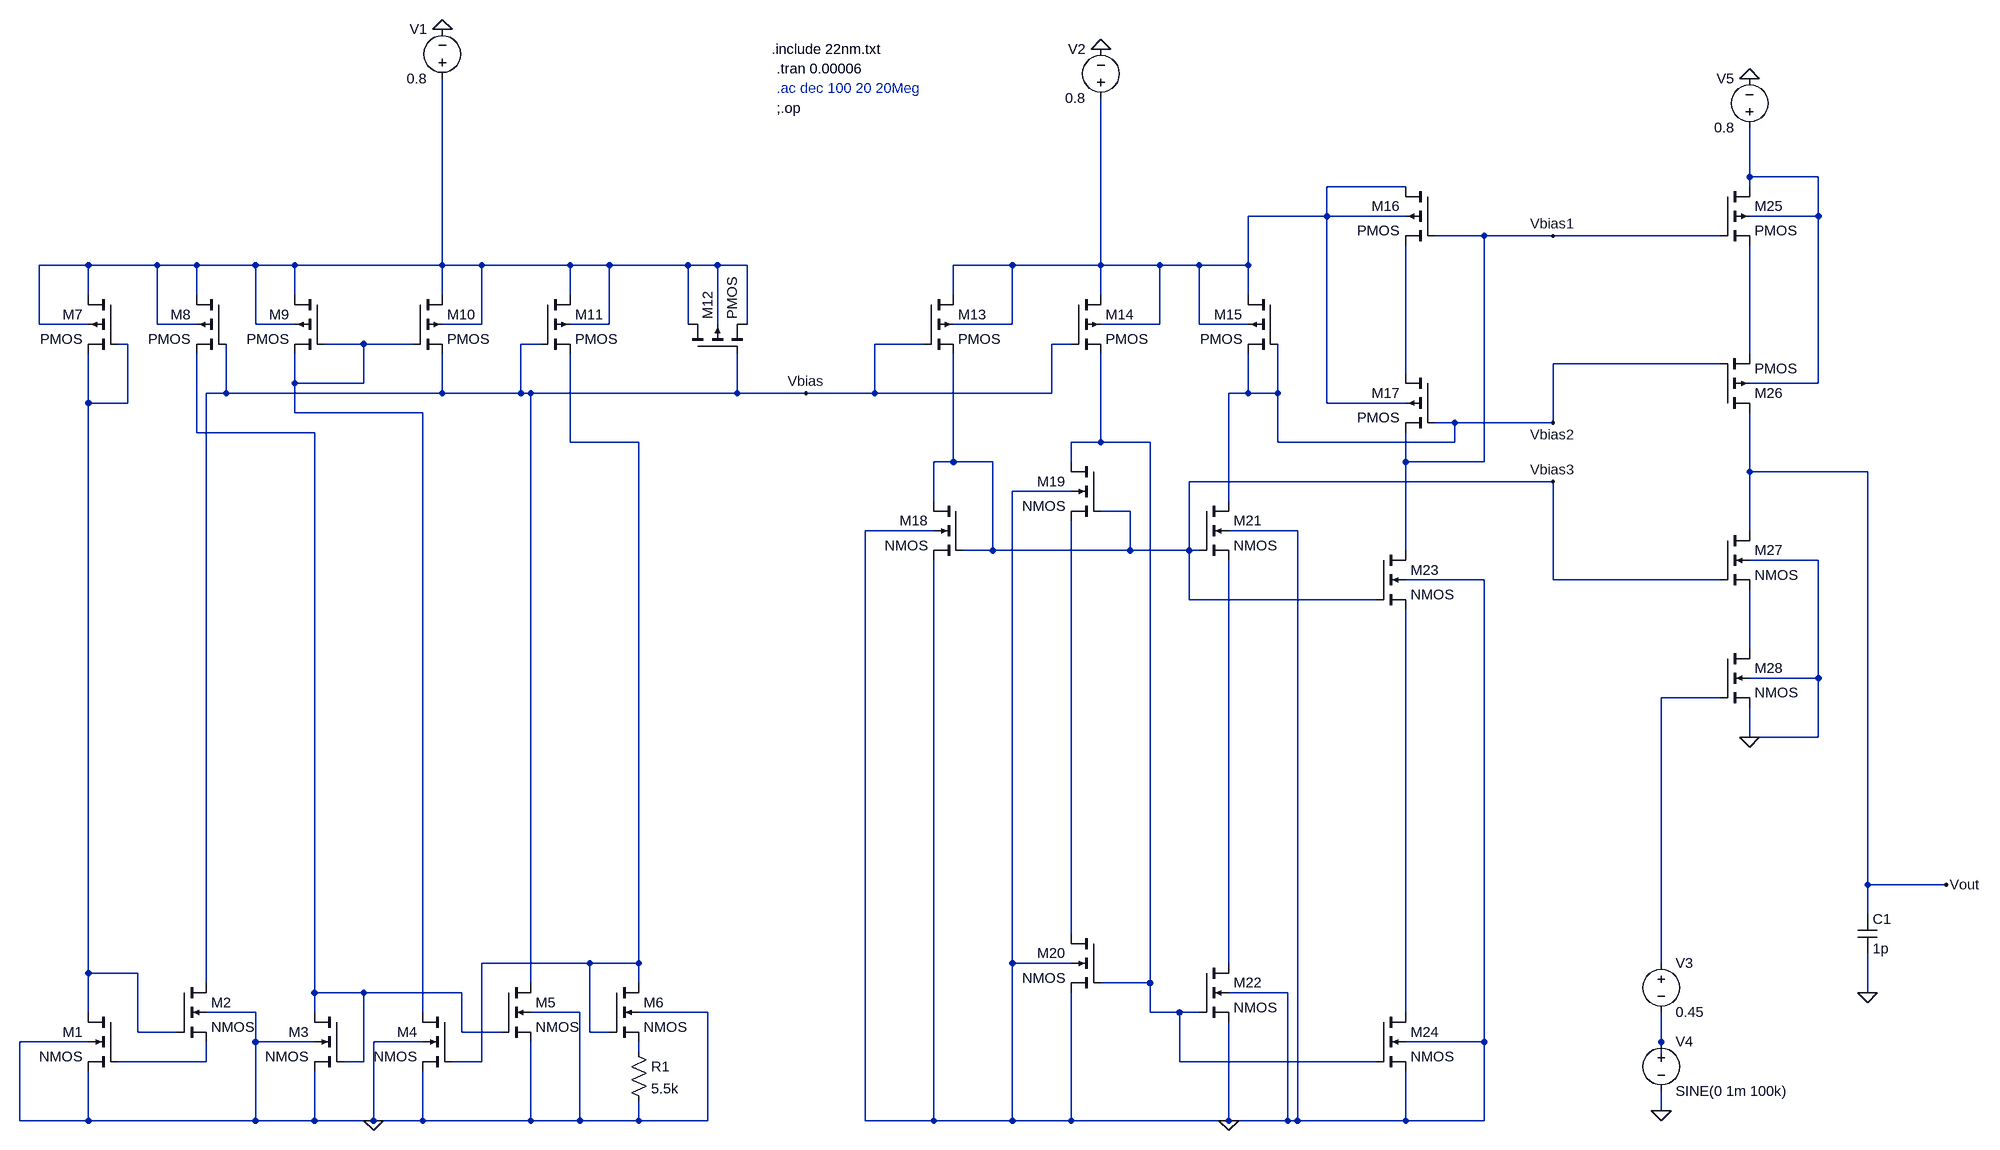
[diagram p0: schematic 22nm_aman3.asc]
22nm_aman3.asc, the LTspice schematic file:
Version 4
SHEET 1 1816 1108
WIRE 1232 -448 1232 -528
WIRE 1344 -448 1232 -448
WIRE 672 -432 544 -432
WIRE 1232 -432 1232 -448
WIRE 544 -384 544 -432
WIRE 544 -384 416 -384
WIRE 672 -384 544 -384
WIRE 1344 -384 1344 -448
WIRE 1344 -384 1232 -384
WIRE 800 -352 720 -352
WIRE 912 -352 800 -352
WIRE 1184 -352 912 -352
WIRE -1472 -304 -1552 -304
WIRE -1360 -304 -1472 -304
WIRE -1296 -304 -1360 -304
WIRE -1200 -304 -1296 -304
WIRE -1136 -304 -1200 -304
WIRE -896 -304 -896 -608
WIRE -896 -304 -1136 -304
WIRE -832 -304 -896 -304
WIRE -688 -304 -832 -304
WIRE -624 -304 -688 -304
WIRE -496 -304 -624 -304
WIRE -448 -304 -496 -304
WIRE -400 -304 -448 -304
WIRE 32 -304 -64 -304
WIRE 176 -304 176 -576
WIRE 176 -304 32 -304
WIRE 272 -304 176 -304
WIRE 336 -304 272 -304
WIRE 416 -304 416 -384
WIRE 416 -304 336 -304
WIRE -1472 -256 -1472 -304
WIRE -1296 -256 -1296 -304
WIRE -1136 -256 -1136 -304
WIRE -896 -256 -896 -304
WIRE -688 -256 -688 -304
WIRE -64 -256 -64 -304
WIRE 176 -256 176 -304
WIRE 416 -256 416 -304
WIRE -1552 -208 -1552 -304
WIRE -1472 -208 -1552 -208
WIRE -1360 -208 -1360 -304
WIRE -1296 -208 -1360 -208
WIRE -1200 -208 -1200 -304
WIRE -1136 -208 -1200 -208
WIRE -832 -208 -832 -304
WIRE -832 -208 -896 -208
WIRE -624 -208 -624 -304
WIRE -624 -208 -688 -208
WIRE -496 -208 -496 -304
WIRE -448 -208 -448 -304
WIRE -400 -208 -400 -304
WIRE 32 -208 32 -304
WIRE 32 -208 -64 -208
WIRE 272 -208 272 -304
WIRE 272 -208 176 -208
WIRE 336 -208 336 -304
WIRE 416 -208 336 -208
WIRE -1408 -176 -1424 -176
WIRE -1024 -176 -1088 -176
WIRE -944 -176 -1024 -176
WIRE -736 -176 -768 -176
WIRE -112 -176 -192 -176
WIRE 128 -176 96 -176
WIRE 1232 -160 1232 -336
WIRE 1184 -144 912 -144
WIRE 672 -128 672 -336
WIRE -1136 -112 -1136 -160
WIRE -1024 -112 -1024 -176
WIRE -1024 -112 -1136 -112
WIRE 1344 -112 1344 -384
WIRE 1344 -112 1232 -112
WIRE -1248 -96 -1248 -176
WIRE -1248 -96 -1280 -96
WIRE -896 -96 -896 -160
WIRE -896 -96 -1248 -96
WIRE -768 -96 -768 -176
WIRE -768 -96 -896 -96
WIRE -752 -96 -768 -96
WIRE -416 -96 -416 -160
WIRE -416 -96 -752 -96
WIRE -304 -96 -416 -96
WIRE -192 -96 -192 -176
WIRE -192 -96 -304 -96
WIRE 96 -96 96 -176
WIRE 96 -96 -192 -96
WIRE 416 -96 416 -160
WIRE 416 -96 384 -96
WIRE 464 -96 464 -176
WIRE 464 -96 416 -96
WIRE -1472 -80 -1472 -160
WIRE -1408 -80 -1408 -176
WIRE -1408 -80 -1472 -80
WIRE 544 -80 544 -384
WIRE 672 -80 544 -80
WIRE -1136 -64 -1136 -112
WIRE -928 -64 -1136 -64
WIRE 752 -48 720 -48
WIRE 912 -48 912 -144
WIRE 912 -48 752 -48
WIRE -1296 -32 -1296 -160
WIRE -1104 -32 -1296 -32
WIRE -688 -16 -688 -160
WIRE -576 -16 -688 -16
WIRE 176 -16 176 -160
WIRE 176 -16 128 -16
WIRE 256 -16 176 -16
WIRE 464 -16 464 -96
WIRE 752 -16 752 -48
WIRE 752 -16 464 -16
WIRE -64 16 -64 -160
WIRE -64 16 -96 16
WIRE 0 16 -64 16
WIRE 128 16 128 -16
WIRE 672 16 672 -32
WIRE 800 16 800 -352
WIRE 800 16 672 16
WIRE 1232 32 1232 -64
WIRE 1424 32 1232 32
WIRE 912 48 320 48
WIRE 128 64 32 64
WIRE -96 80 -96 16
WIRE 384 80 384 -96
WIRE 224 96 176 96
WIRE -96 128 -208 128
WIRE 496 128 384 128
WIRE 1232 128 1232 32
WIRE 0 160 0 16
WIRE 0 160 -48 160
WIRE 224 160 224 96
WIRE 224 160 0 160
WIRE 320 160 320 48
WIRE 320 160 224 160
WIRE 336 160 320 160
WIRE 672 160 672 16
WIRE 1344 176 1232 176
WIRE 800 208 672 208
WIRE 912 208 912 48
WIRE 1184 208 912 208
WIRE 320 240 320 160
WIRE 624 240 320 240
WIRE 1232 320 1232 224
WIRE 1344 368 1344 176
WIRE 1344 368 1232 368
WIRE 1184 400 1088 400
WIRE 1232 464 1232 416
WIRE 1344 464 1344 368
WIRE 1344 464 1232 464
WIRE 1424 704 1424 32
WIRE 1552 704 1424 704
WIRE 1424 752 1424 704
WIRE 128 784 128 112
WIRE -656 832 -832 832
WIRE -576 832 -576 -16
WIRE -576 832 -656 832
WIRE 32 832 32 64
WIRE 128 832 32 832
WIRE 384 832 384 176
WIRE 1088 832 1088 400
WIRE -1472 848 -1472 -80
WIRE -1392 848 -1472 848
WIRE -1280 864 -1280 -96
WIRE -752 864 -752 -96
WIRE -576 864 -576 832
WIRE 256 864 256 -16
WIRE 256 864 176 864
WIRE -1104 880 -1104 -32
WIRE -1024 880 -1104 880
WIRE -864 880 -1024 880
WIRE 480 880 384 880
WIRE 1424 880 1424 816
WIRE -1472 912 -1472 848
WIRE -1200 912 -1280 912
WIRE -1104 912 -1104 880
WIRE -928 912 -928 -64
WIRE -672 912 -752 912
WIRE -464 912 -576 912
WIRE 256 912 256 864
WIRE 304 912 256 912
WIRE 336 912 304 912
WIRE 672 912 672 256
WIRE -1392 944 -1392 848
WIRE -1328 944 -1392 944
WIRE -864 944 -864 880
WIRE -800 944 -864 944
WIRE -656 944 -656 832
WIRE -624 944 -656 944
WIRE -1472 960 -1584 960
WIRE -1200 960 -1200 912
WIRE -1104 960 -1200 960
WIRE -928 960 -1008 960
WIRE 800 960 800 208
WIRE 800 960 672 960
WIRE 1088 960 1088 912
WIRE -576 976 -576 960
WIRE -1280 992 -1280 960
WIRE -1280 992 -1424 992
WIRE -1024 992 -1024 880
WIRE -1024 992 -1056 992
WIRE -832 992 -832 832
WIRE -832 992 -880 992
WIRE 304 992 304 912
WIRE 624 992 304 992
WIRE 1088 992 1088 960
WIRE 1088 1072 1088 1040
WIRE -1584 1088 -1584 960
WIRE -1472 1088 -1472 1008
WIRE -1472 1088 -1584 1088
WIRE -1200 1088 -1200 960
WIRE -1200 1088 -1472 1088
WIRE -1104 1088 -1104 1008
WIRE -1104 1088 -1200 1088
WIRE -1008 1088 -1008 960
WIRE -1008 1088 -1104 1088
WIRE -928 1088 -928 1008
WIRE -928 1088 -1008 1088
WIRE -752 1088 -752 960
WIRE -752 1088 -928 1088
WIRE -672 1088 -672 912
WIRE -672 1088 -752 1088
WIRE -576 1088 -576 1056
WIRE -576 1088 -672 1088
WIRE -464 1088 -464 912
WIRE -464 1088 -576 1088
WIRE -208 1088 -208 128
WIRE -96 1088 -96 176
WIRE -96 1088 -208 1088
WIRE 32 1088 32 832
WIRE 32 1088 -96 1088
WIRE 128 1088 128 880
WIRE 128 1088 32 1088
WIRE 384 1088 384 928
WIRE 384 1088 128 1088
WIRE 480 1088 480 880
WIRE 480 1088 384 1088
WIRE 496 1088 496 128
WIRE 496 1088 480 1088
WIRE 672 1088 672 1008
WIRE 672 1088 496 1088
WIRE 800 1088 800 960
WIRE 800 1088 672 1088
FLAG -1008 1088 0
FLAG -896 -688 0
FLAG -304 -96 Vbias
FLAG 384 1088 0
FLAG 176 -656 0
FLAG 912 -352 Vbias1
FLAG 912 -48 Vbias2
FLAG 912 48 Vbias3
FLAG 1088 1072 0
FLAG 1232 464 0
FLAG 1232 -608 0
FLAG 1424 880 0
FLAG 1552 704 Vout
SYMBOL nmos4 -1424 912 M0
SYMATTR InstName M1
SYMATTR Value2 l=0.044u w=0.22u
SYMBOL nmos4 -1328 864 R0
SYMATTR InstName M2
SYMATTR Value2 l=0.044u w=0.088u
SYMBOL nmos4 -1056 912 M0
SYMATTR InstName M3
SYMATTR Value2 l=0.044u w=0.22u
SYMBOL nmos4 -880 912 M0
SYMATTR InstName M4
SYMATTR Value2 l=0.044u w=0.22u
SYMBOL nmos4 -800 864 R0
SYMATTR InstName M5
SYMATTR Value2 l=0.044u w=0.22u
SYMBOL nmos4 -624 864 R0
SYMATTR InstName M6
SYMATTR Value2 l=0.044u w=0.66u
SYMBOL pmos4 -1424 -256 M0
SYMATTR InstName M7
SYMATTR Value2 l=0.44u w=0.22u
SYMBOL pmos4 -1248 -256 M0
SYMATTR InstName M8
SYMATTR Value2 l=0.044u w=0.528u
SYMBOL pmos4 -1088 -256 M0
SYMATTR InstName M9
SYMATTR Value2 l=0.044u w=0.528u
SYMBOL pmos4 -944 -256 R0
SYMATTR InstName M10
SYMATTR Value2 l=0.044u w=0.528u
SYMBOL pmos4 -736 -256 R0
SYMATTR InstName M11
SYMATTR Value2 l=0.044u w=0.528u
SYMBOL pmos4 -496 -160 R270
SYMATTR InstName M12
SYMATTR Value2 l=1.1u w=1.1u
SYMBOL res -592 960 R0
SYMATTR InstName R1
SYMATTR Value 5.5k
SYMBOL voltage -896 -592 R180
WINDOW 0 24 96 Left 2
WINDOW 3 24 16 Left 2
WINDOW 123 0 0 Left 0
WINDOW 39 0 0 Left 0
SYMATTR InstName V1
SYMATTR Value 0.8
SYMBOL pmos4 -112 -256 R0
SYMATTR InstName M13
SYMATTR Value2 l=0.044u w=0.528u
SYMBOL pmos4 128 -256 R0
SYMATTR InstName M14
SYMATTR Value2 l=0.044u w=0.528u
SYMBOL pmos4 464 -256 M0
SYMATTR InstName M15
SYMATTR Value2 l=0.056u w=0.66u
SYMBOL pmos4 720 -432 M0
SYMATTR InstName M16
SYMATTR Value2 l=0.02u w=1.8u
SYMBOL pmos4 720 -128 M0
SYMATTR InstName M17
SYMATTR Value2 l=0.044u w=0.528u
SYMBOL nmos4 -48 80 M0
SYMATTR InstName M18
SYMATTR Value2 l=0.076u w=0.07u
SYMBOL nmos4 176 16 M0
SYMATTR InstName M19
SYMATTR Value2 l=0.044u w=0.22u
SYMBOL nmos4 176 784 M0
SYMATTR InstName M20
SYMATTR Value2 l=0.044u w=0.22u
SYMBOL nmos4 336 80 R0
SYMATTR InstName M21
SYMATTR Value2 l=0.044u w=0.22u
SYMBOL nmos4 336 832 R0
SYMATTR InstName M22
SYMATTR Value2 l=0.044u w=0.22u
SYMBOL nmos4 624 160 R0
SYMATTR InstName M23
SYMATTR Value2 l=0.044u w=0.22u
SYMBOL nmos4 624 912 R0
SYMATTR InstName M24
SYMATTR Value2 l=0.044u w=0.22u
SYMBOL voltage 176 -560 R180
WINDOW 0 24 96 Left 2
WINDOW 3 24 16 Left 2
WINDOW 123 0 0 Left 0
WINDOW 39 0 0 Left 0
SYMATTR InstName V2
SYMATTR Value 0.8
SYMBOL pmos4 1184 -432 R0
SYMATTR InstName M25
SYMATTR Value2 l=0.044u w=1.0472u
SYMBOL pmos4 1184 -64 M180
SYMATTR InstName M26
SYMATTR Value2 l=0.044u w=1.0472u
SYMBOL nmos4 1184 128 R0
SYMATTR InstName M27
SYMATTR Value2 l=0.044u w=0.5236u
SYMBOL nmos4 1184 320 R0
SYMATTR InstName M28
SYMATTR Value2 l=0.044u w=0.5236u
SYMBOL voltage 1088 816 R0
WINDOW 123 0 0 Left 0
WINDOW 39 0 0 Left 0
SYMATTR InstName V3
SYMATTR Value 0.45
SYMBOL voltage 1088 944 R0
WINDOW 39 0 0 Left 0
SYMATTR Value2 AC 6
SYMATTR InstName V4
SYMATTR Value SINE(0 1m 100k)
SYMBOL voltage 1232 -512 R180
WINDOW 0 24 96 Left 2
WINDOW 3 24 16 Left 2
WINDOW 123 0 0 Left 0
WINDOW 39 0 0 Left 0
SYMATTR InstName V5
SYMATTR Value 0.8
SYMBOL cap 1408 752 R0
SYMATTR InstName C1
SYMATTR Value 1p
TEXT -360 -656 Left 2 !.include 22nm.txt
TEXT -352 -624 Left 2 !.tran 0.00006
TEXT -352 -592 Left 2 ;.ac dec 100 20 20Meg
TEXT -352 -560 Left 2 !;.op

The netlist it stands for:
* 22nm_aman3.asc
M1 N004 N018 0 0 NMOS l=0.044u w=0.22u
M2 Vbias N004 N018 0 NMOS l=0.044u w=0.088u
M3 N008 N008 0 0 NMOS l=0.044u w=0.22u
M4 N005 N009 0 0 NMOS l=0.044u w=0.22u
M5 Vbias N008 0 0 NMOS l=0.044u w=0.22u
M6 N009 N009 N017 0 NMOS l=0.044u w=0.66u
M7 N003 N004 N004 N003 PMOS l=0.44u w=0.22u
M8 N003 Vbias N008 N003 PMOS l=0.044u w=0.528u
M9 N003 N005 N005 N003 PMOS l=0.044u w=0.528u
M10 N003 N005 Vbias N003 PMOS l=0.044u w=0.528u
M11 N003 Vbias N009 N003 PMOS l=0.044u w=0.528u
M12 N003 Vbias N003 N003 PMOS l=1.1u w=1.1u
R1 N017 0 5.5k
V1 N003 0 0.8
M13 N002 Vbias Vbias3 N002 PMOS l=0.044u w=0.528u
M14 N002 Vbias N010 N002 PMOS l=0.044u w=0.528u
M15 N002 Vbias2 Vbias2 N002 PMOS l=0.056u w=0.66u
M16 N002 Vbias1 N007 N002 PMOS l=0.02u w=1.8u
M17 N007 Vbias2 Vbias1 N002 PMOS l=0.044u w=0.528u
M18 Vbias3 Vbias3 0 0 NMOS l=0.076u w=0.07u
M19 N010 Vbias3 N013 0 NMOS l=0.044u w=0.22u
M20 N013 N010 0 0 NMOS l=0.044u w=0.22u
M21 Vbias2 Vbias3 N014 0 NMOS l=0.044u w=0.22u
M22 N014 N010 0 0 NMOS l=0.044u w=0.22u
M23 Vbias1 Vbias3 N015 0 NMOS l=0.044u w=0.22u
M24 N015 N010 0 0 NMOS l=0.044u w=0.22u
V2 N002 0 0.8
M25 N001 Vbias1 N006 N001 PMOS l=0.044u w=1.0472u
M26 Vout Vbias2 N006 N001 PMOS l=0.044u w=1.0472u
M27 Vout Vbias3 N011 0 NMOS l=0.044u w=0.5236u
M28 N011 N012 0 0 NMOS l=0.044u w=0.5236u
V3 N012 N016 0.45
V4 N016 0 SINE(0 1m 100k) AC 6
V5 N001 0 0.8
C1 Vout 0 1p
.model NMOS NMOS
.model PMOS PMOS
.lib standard.mos
.include 22nm.txt
.tran 0.00006
* .ac dec 100 20 20Meg
;.op
.backanno
.end